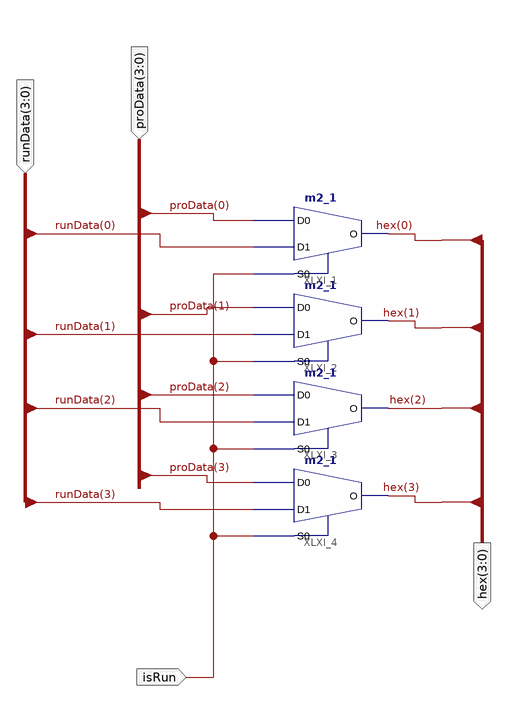
[diagram p0: schematic sheet 1]
// Xilinx ISE schematic runORpro.sch (spartan3e) as structural Verilog: 4 symbols, 4 ports
module runORpro (
  input  isRun,
  input  [3:0] runData,
  input  [3:0] proData,
  output [3:0] hex
);

  m2_1 XLXI_2 (.D0(proData[1]), .D1(runData[1]), .S0(isRun), .O(hex[1]));
  m2_1 XLXI_4 (.D0(proData[3]), .D1(runData[3]), .S0(isRun), .O(hex[3]));
  m2_1 XLXI_3 (.D0(proData[2]), .D1(runData[2]), .S0(isRun), .O(hex[2]));
  m2_1 XLXI_1 (.D0(proData[0]), .D1(runData[0]), .S0(isRun), .O(hex[0]));
endmodule
